# Altium schematic sheet 电机驱动原理图.SchDoc
size A
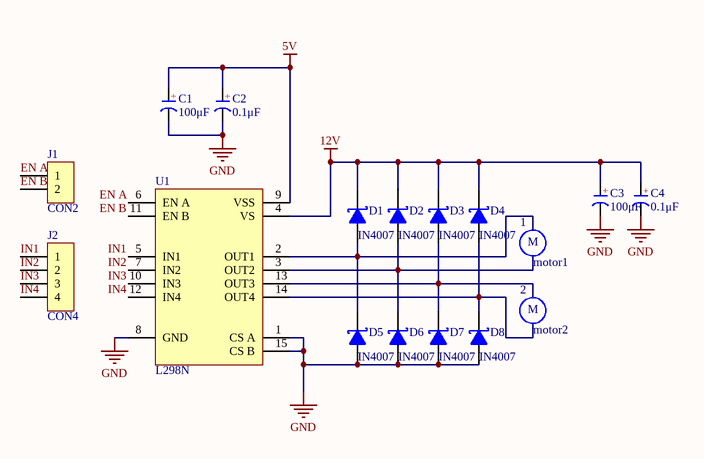
[diagram p0: 电机驱动原理图.SchDoc]

## Parts
1  motor1
2  motor2
C1  100μF
C2  0.1μF
C3  100μF
C4  0.1μF
D1  IN4007
D2  IN4007
D3  IN4007
D4  IN4007
D5  IN4007
D6  IN4007
D7  IN4007
D8  IN4007
J1  CON2  [2PIN杜邦插座_1.27mm]
J2  CON4  [HDR1X4]
U1  L298N

## Nets
5V: C1.1(A) C2.1(A) U1.9(VSS)
12V: C3.1(A) C4.1(A) D1.2(K) D2.2(K) D3.2(K) D4.2(K) U1.4(VS)
GND: C1.2(K) C2.2(K) C3.2(K) C4.2(K) D5.1(A) D6.1(A) D7.1(A) D8.1(A) U1.1(CS_A) U1.8(GND) U1.15(CS_B)
EN A: J1.1 U1.6(EN_A)
EN B: J1.2 U1.11(EN_B)
IN1: J2.1 U1.5(IN1)
IN2: J2.2 U1.7(IN2)
IN3: J2.3 U1.10(IN3)
IN4: J2.4 U1.12(IN4)
NetD1_1: D1.1(A) D5.2(K) U1.2(OUT1)
NetD2_1: D2.1(A) D6.2(K) U1.3(OUT2)
NetD3_1: D3.1(A) D7.2(K) U1.13(OUT3)
NetD4_1: D4.1(A) D8.2(K) U1.14(OUT4)

## Notes on the sheet
- (in symbol 极性电容) +
- (in symbol 电机) M

## Library data of the parts
1 2 = 电机
C1-C4 = 极性电容
D1-D8 = 肖特基二极管
J1 = CON2: Connector
J2 = CON4: Connector